# EAGLE design GNSS_Chip_Antenna_Evaluation_Board (EAGLE 9.3.0)
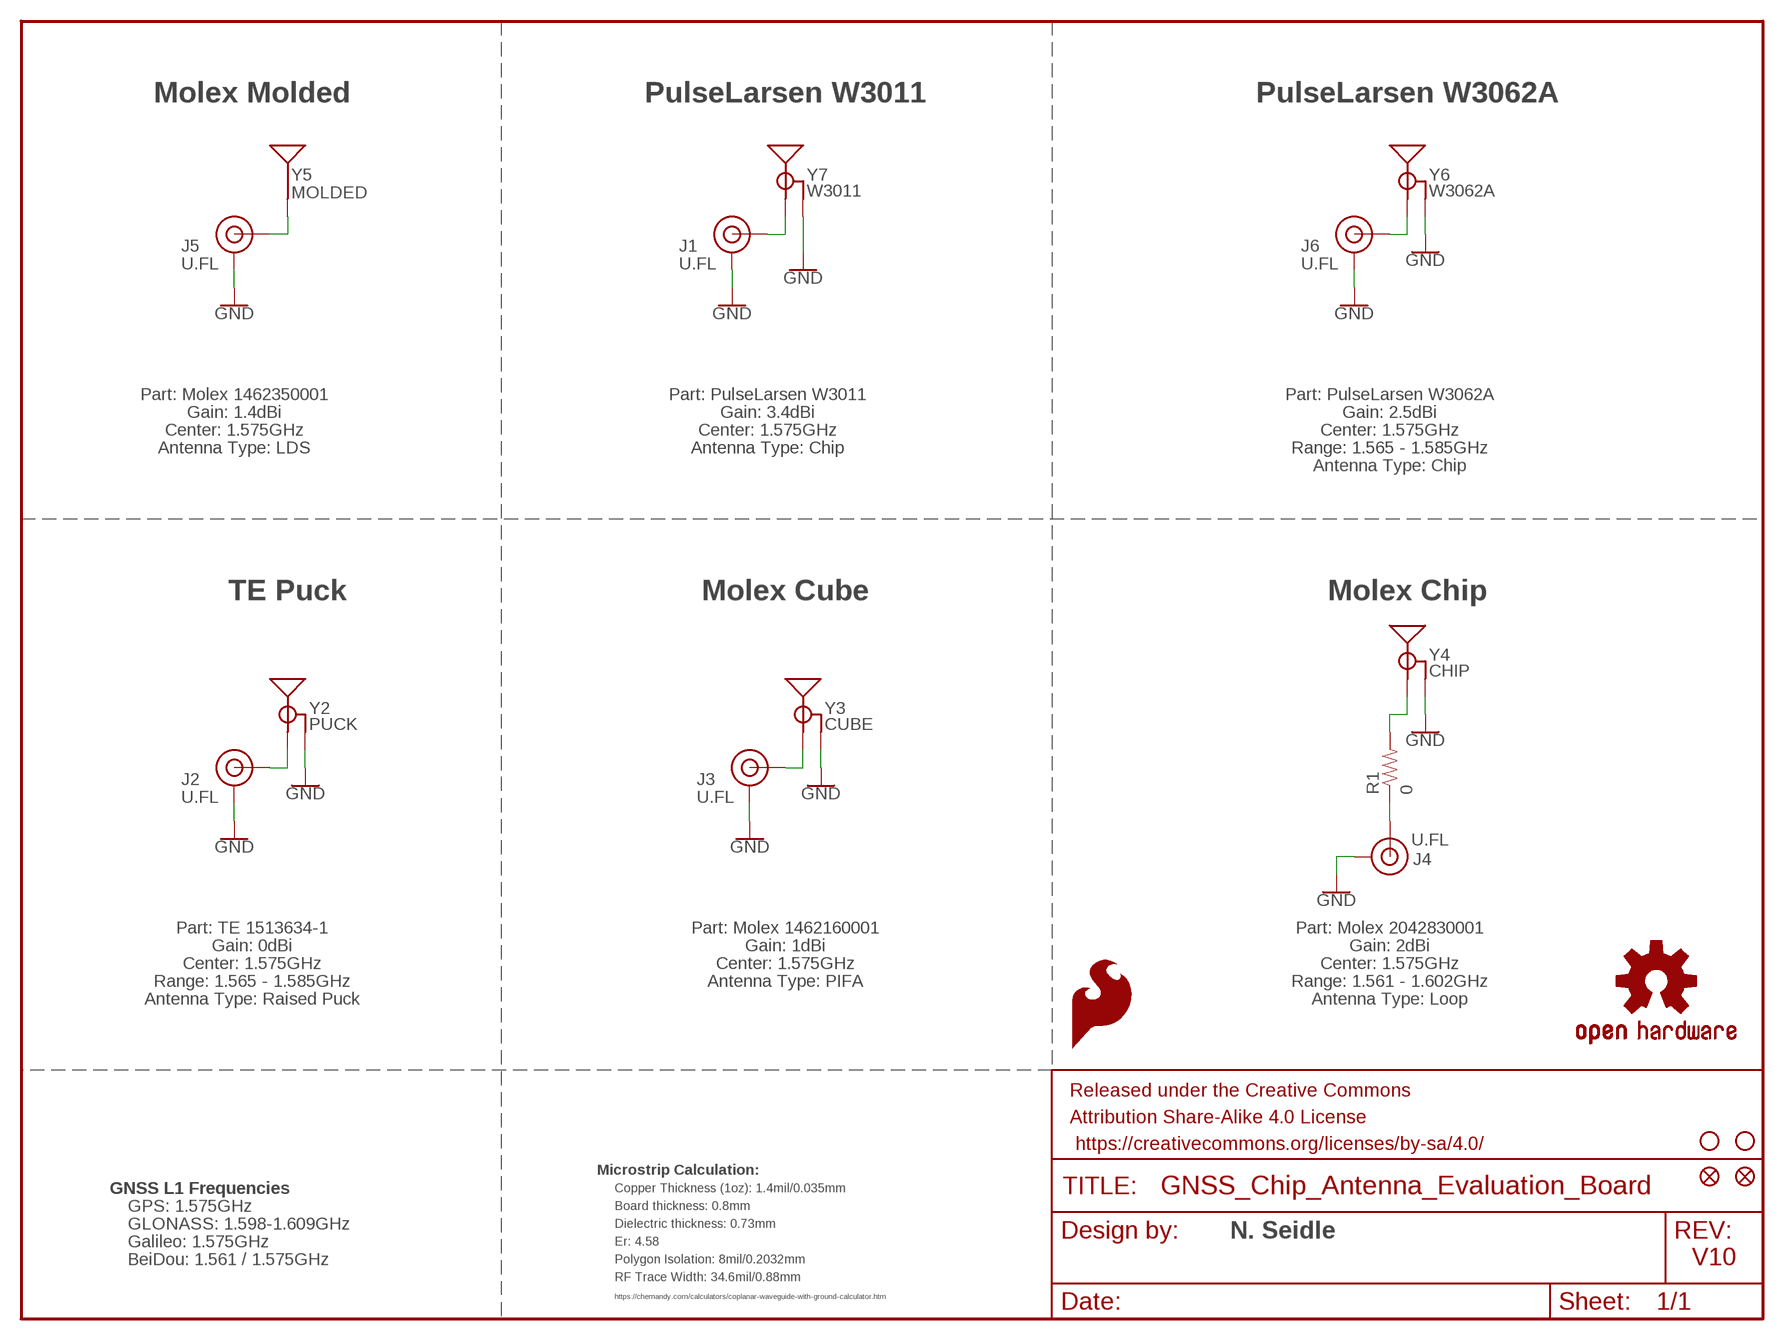
[diagram p0: schematic, sheet 1]

## Parts
FRAME1  FRAME-LETTER  [CREATIVE_COMMONS]
J1  U.FL  U.FL2PIN  [U.FL]
J2  U.FL  U.FL2PIN  [U.FL]
J3  U.FL  U.FL2PIN  [U.FL]
J4  U.FL  U.FL2PIN  [U.FL]
J5  U.FL  U.FL2PIN  [U.FL]
J6  U.FL  U.FL2PIN  [U.FL]
JP5  STAND-OFF  [STAND-OFF]
JP6  STAND-OFF  [STAND-OFF]
JP8  FIDUCIAL1X2  [FIDUCIAL-1X2]
JP9  FIDUCIAL1X2  [FIDUCIAL-1X2]
LOGO1  SFE_LOGO_FLAME.1EXP  [SFE_LOGO_FLAME_COPPER_EXPOSED_.1]
LOGO2  SFE_LOGO_FLAME.1EXP  [SFE_LOGO_FLAME_COPPER_EXPOSED_.1]
LOGO3  SFE_LOGO_FLAME.1EXP  [SFE_LOGO_FLAME_COPPER_EXPOSED_.1]
LOGO4  SFE_LOGO_FLAME.1EXP  [SFE_LOGO_FLAME_COPPER_EXPOSED_.1]
LOGO5  SFE_LOGO_FLAME.1EXP  [SFE_LOGO_FLAME_COPPER_EXPOSED_.1]
LOGO6  SFE_LOGO_FLAME.1EXP  [SFE_LOGO_FLAME_COPPER_EXPOSED_.1]
R1  0  0OHM-0402-1/10W  [0402]
U$16  OSHW-LOGOS  [OSHW-LOGO-S]
Y2  PUCK  GPS_CHIP_ANTENNAPUCK  [TE_PUCK]
Y3  CUBE  GPS_CHIP_ANTENNACUBE  [MOLEX_GNSS_CUBE]
Y4  CHIP  GPS_CHIP_ANTENNA2042830001  [MOLEX_GNSS_CHIP]
Y5  MOLDED  GPS_CHIP_ANTENNA_NOGNDMOLDED  [MLOEX_GNSS_MOLDED]
Y6  W3062A  GPS_CHIP_ANTENNAW3062A  [W3062A]
Y7  W3011  GPS_CHIP_ANTENNAW3011  [W3011]

## Nets
FEED1: J1.FEED(SIGNAL) Y7.1(SIGNAL)
FEED2: J5.FEED(SIGNAL) Y5.FEED(SIGNAL)
FEED3: J2.FEED(SIGNAL) Y2.S(SIGNAL)
FEED4: J3.FEED(SIGNAL) Y3.FEED(SIGNAL)
FEED5: J4.FEED(SIGNAL) R1.1
FEED6: J6.FEED(SIGNAL) Y6.FEED(SIGNAL)
GND: J1.1(GND) J1.2(GND) J2.1(GND) J2.2(GND) J3.1(GND) J3.2(GND) J4.1(GND) J4.2(GND) J5.1(GND) J5.2(GND) J6.1(GND) J6.2(GND) Y2.1(GND) Y2.2(GND) Y2.3(GND) Y3.GND Y4.1(GND) Y4.2(GND) Y4.3(GND) Y6.GND Y7.2(GND) Y7.3(GND)
N$5: R1.2 Y4.FEED(SIGNAL)

## Notes on the sheet
- Molex Molded | PulseLarsen W3011 | PulseLarsen W3062A
- Part: Molex 1462350001 | Part: PulseLarsen W3011 | Part: PulseLarsen W3062A
- Gain: 1.4dBi | Gain: 3.4dBi | Gain: 2.5dBi
- Center: 1.575GHz | Center: 1.575GHz | Center: 1.575GHz
- Antenna Type: LDS | Antenna Type: Chip | Range: 1.565 - 1.585GHz
- Antenna Type: Chip
- TE Puck | Molex Cube | Molex Chip
- Part: TE 1513634-1 | Part: Molex 1462160001 | Part: Molex 2042830001
- Gain: 0dBi | Gain: 1dBi | Gain: 2dBi
- Center: 1.575GHz | Center: 1.575GHz | Center: 1.575GHz
- Range: 1.565 - 1.585GHz | Antenna Type: PIFA | Range: 1.561 - 1.602GHz
- Antenna Type: Raised Puck | Antenna Type: Loop
- Microstrip Calculation:
- GNSS L1 Frequencies | Copper Thickness (1oz): 1.4mil/0.035mm
- GPS: 1.575GHz | Board thickness: 0.8mm
- GLONASS: 1.598-1.609GHz | Dielectric thickness: 0.73mm | N. Seidle
- Galileo: 1.575GHz | Er: 4.58
- BeiDou: 1.561 / 1.575GHz | Polygon Isolation: 8mil/0.2032mm | V10
- RF Trace Width: 34.6mil/0.88mm
- https://chemandy.com/calculators/coplanar-waveguide-with-ground-calculator.htm

## Library data of the parts
FRAME1 = SparkFun-Aesthetics:FRAME-LETTER: Schematic Frame - Letter Standard 8.5x11 US Letter frame
J1-J6 = SparkFun-Connectors:U.FL2PIN: SMD Antenna Connector - U.FL 2mm height, 3.0mm x 3.0mm receptacle size. SparkFun Products: SparkFun WiFi Shield - ESP8266 <https://www.sparkfun.com/products/13287> SparkFun ESP8266 Thing <https://www.sparkfun.com/products/13231> SparkFun MiniGen - Pro Mini Signal Generator Shield <https://www.sparkfun.com/products/11420>; PROD_ID: CONN-09193; SF_ID: WRL-09144
JP5 JP6 = SparkFun:STAND-OFF: Stand Off This is the mechanical footprint for a #4 phillips button head screw. Use the keepout ring to avoid running the screw head into surrounding components. SKU : PRT-00447
JP8 JP9 = SparkFun:FIDUCIAL: Fiducial Alignment Points Various fiducial points for machine vision alignment.
LOGO1-LOGO6 = SparkFun-Aesthetics:SFE_LOGO_FLAME: SparkFun Flame Logo This is the SparkFun flame logo. The logo on the schematic will always be the same size; the package variant is the height of the flame. Default layer for the logo on the board is tSilk.
R1 = SparkFun-Resistors:0OHM: 0Ω resistor A resistor is a passive two-terminal electrical component that implements electrical resistance as a circuit element. Resistors act to reduce current flow, and, at the same time, act to lower voltage levels within circuits. - Wikipedia; PROD_ID: RES-14244
U$16 = SparkFun-Aesthetics:OSHW-LOGO: Open-Source Hardware (OSHW) Logo This logo indicates the piece of hardware it is found on incorporates a OSHW license and/or adheres to the definition of open source hardware found here: http://freedomdefined.org/OSHW
Y2 = SparkFun-GPS:GPS_CHIP_ANTENNA; PROD_ID: ANT-14308
Y3 = SparkFun-GPS:GPS_CHIP_ANTENNA; PROD_ID: ANT-14307
Y4 = SparkFun-GPS:GPS_CHIP_ANTENNA; PROD_ID: ANT-14306
Y5 = SparkFun-GPS:GPS_CHIP_ANTENNA_NOGND; PROD_ID: ANT-14303
Y6 = SparkFun-GPS:GPS_CHIP_ANTENNA; PROD_ID: ANT-14305
Y7 = SparkFun-GPS:GPS_CHIP_ANTENNA; PROD_ID: ANT-14304

## Net classes
1 power: width 0.178 mm

## Board
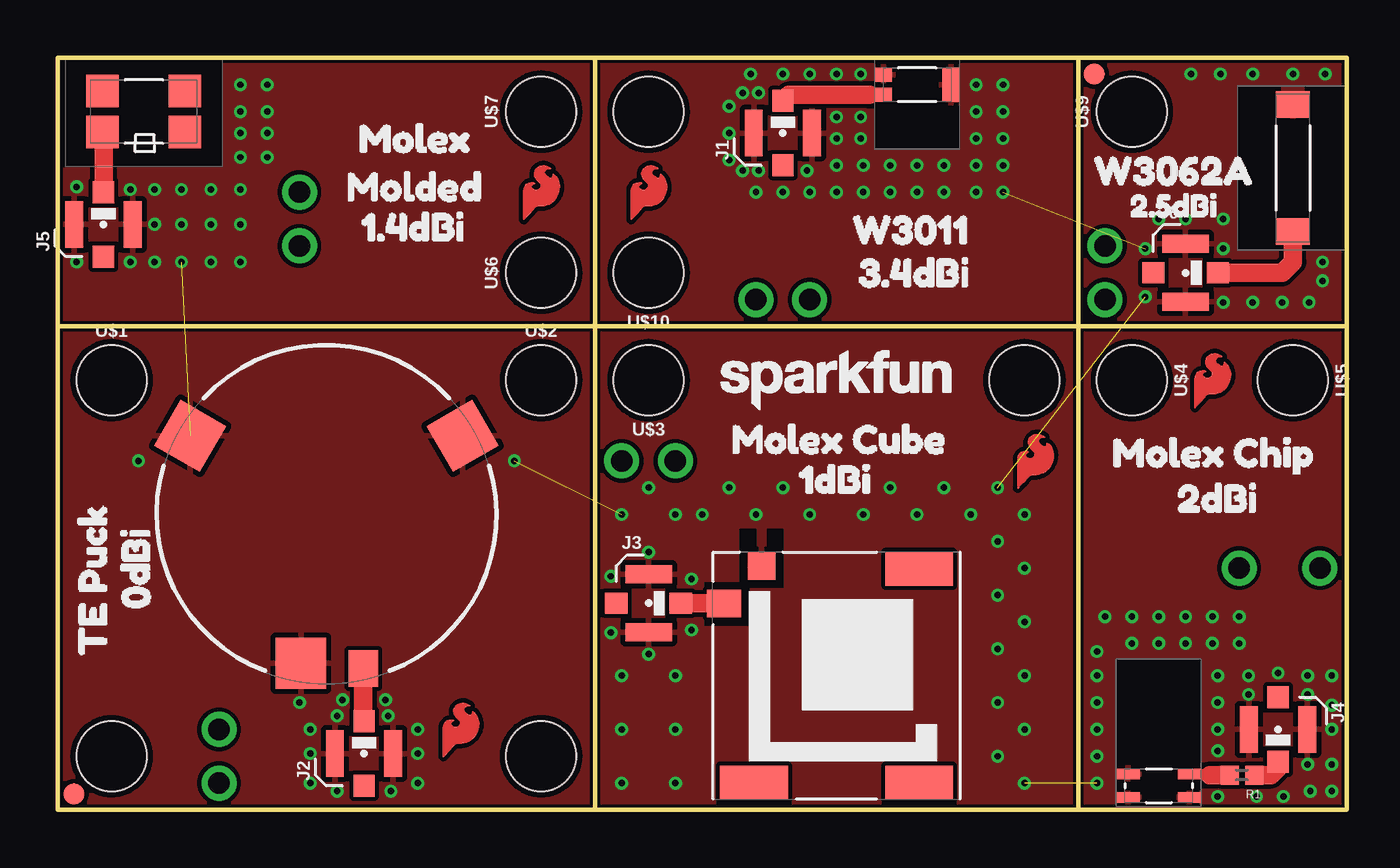
[diagram p1: board, top side]
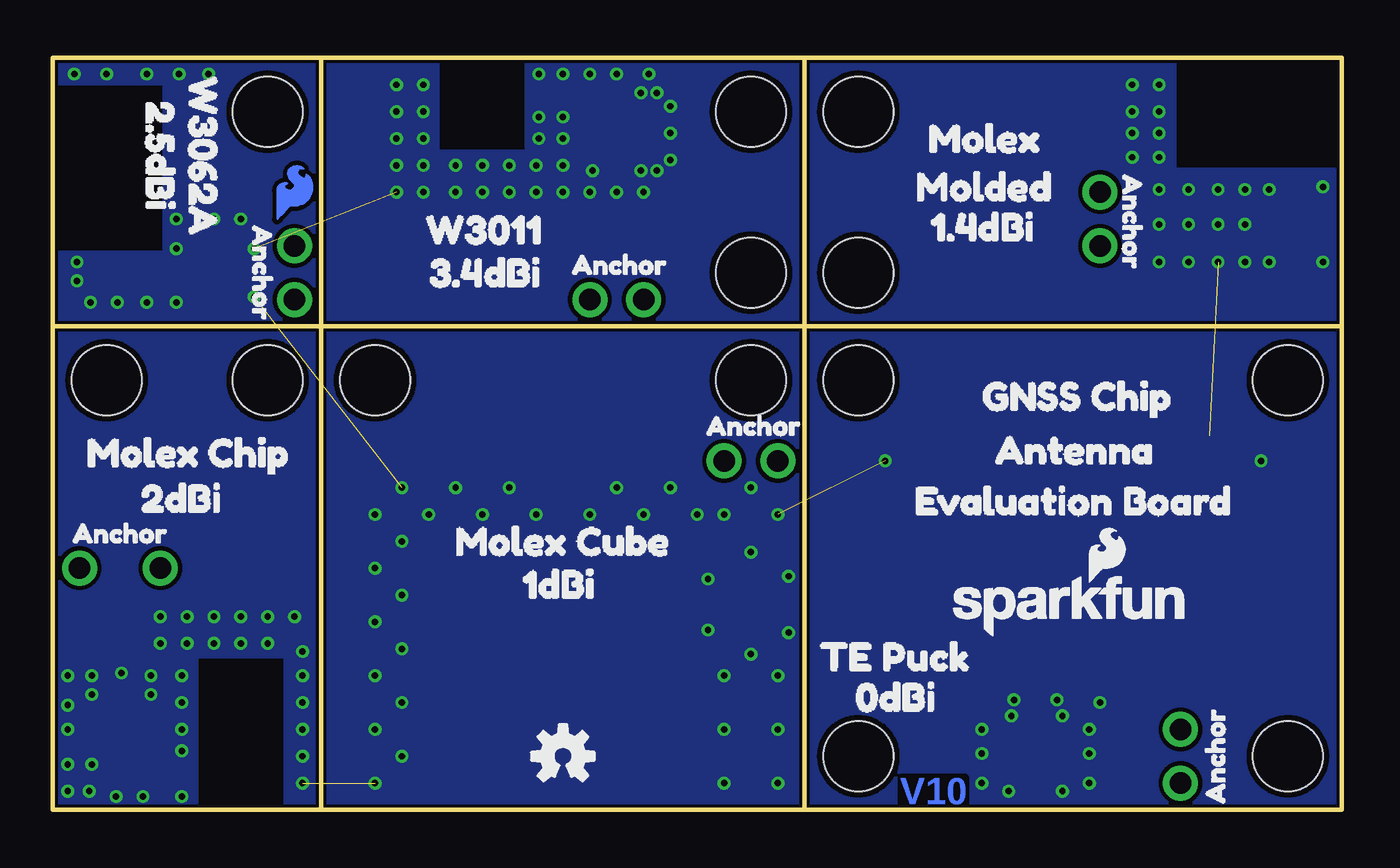
[diagram p2: board, bottom side, seen from below]

Size 60.96 x 35.56 mm. Coordinates in mm from the lower left corner, seen from the top.
Outline: 25.4,35.56 25.4,0
Outline: 48.26,35.56 48.26,0
Outline: 0,22.86 60.96,22.86
Outline: 0,35.56 60.96,35.56 60.96,0 0,0 0,35.56
Copper layers (1*16): Top 0.035mm / dielectric 1.5mm / Bottom 0.035mm
Design rules "SparkFun-2-layer-PCBWay-LIMIT *": minimum track width 6mil, minimum drill 0.3mm, track to track 8mil, track to pad 8mil, pad to pad 8mil, via to via 8mil, smd to smd 8mil, copper to edge 6mil, drill to drill 6mil, minimum pad ring 6mil, minimum via ring 6mil, stop-mask expansion 4mil, vias tented up to drill 25mil, thermal gap 10mil

### Footprints (pad centres in the part's own frame; a part is rotated, then mirrored left to right if it is on the bottom)
U.FL = smd 2.2 x 0.85: 1 0,1.375; 2 0,-1.375 | smd 1.05 x 1: FEED 1.525,0; NC -1.525,0
STAND-OFF = hole 3.302: 0,0
FIDUCIAL-1X2 = smd 1 x 1: 1 0,0
0402 = smd 0.85 x 0.9: 1 -0.58,0; 2 0.58,0
TE_PUCK = smd 2.4 x 2.4: 1 -1.2,-7.03 | smd 2.5 x 2.5 rotated 60: 2 -6.443,3.72 | smd 2.5 x 2.5 rotated 300: 3 6.443,3.72 | smd 1.4 x 1.74: S 1.75,-7.28
MOLEX_GNSS_CUBE = smd 1.61 x 1.3: FEED 5.33,-3.4 | smd 1.3 x 1.32: GND 3.545,-5.2 | smd 3.2 x 1.6: NC1 -3.905,-5.06; NC2 -3.905,5.06; NC3 3.905,5.06
MOLEX_GNSS_CHIP = smd 1.1 x 0.5: 1 1.45,-0.55; 2 -1.45,-0.55; 3 -1.45,0.55; FEED 1.45,0.55
MLOEX_GNSS_MOLDED = smd 1.54 x 1.54: 1 -0.97,-1.95; 2 -0.97,1.95; 3 0.97,1.95; FEED 0.97,-1.95
W3062A = smd 1.25 x 1.61: FEED 3,0; GND -3,0
W3011 = smd 0.8 x 0.65: 1 1.6,0.475; 2 1.6,-0.475 | smd 0.8 x 1.6: 3 -1.6,0

### Placement (x,y rotation side)
FRAME1  3.81,-12.7 0 top  (outside the outline)
J1  34.29,32 90 top
J2  14.48,2.67 90 top
J3  27.94,9.78 0 top
J4  57.72,3.81 270 top
J5  2.16,27.69 90 top
J6  53.34,25.4 0 top
JP1  STAND-OFF  [STAND-OFF]  22.86,2.54 0 top
JP2  STAND-OFF  [STAND-OFF]  2.54,2.54 0 top
JP5  45.72,20.32 180 top
JP6  27.94,33.02 180 top
JP8  49.02,34.8 0 top
JP9  0.76,0.76 0 top
LOGO1  49.53,29.21 0 bottom
LOGO2  54.61,20.32 0 top
LOGO3  27.94,29.21 0 top
LOGO4  22.86,29.21 0 top
LOGO5  46.23,16.51 0 top
LOGO6  19.05,3.81 0 top
R1  56.01,1.65 180 top
U$1  [STAND-OFF]  2.54,20.32 0 top
U$2  [STAND-OFF]  22.86,20.32 0 top
U$3  [STAND-OFF]  27.94,20.32 180 top
U$4  [STAND-OFF]  50.8,20.32 270 top
U$5  [STAND-OFF]  58.42,20.32 270 top
U$6  [STAND-OFF]  22.86,25.4 90 top
U$7  [STAND-OFF]  22.86,33.02 90 top
U$8  [ANCHOR0]  9.91,30.86 270 bottom
U$9  [STAND-OFF]  50.8,33.02 90 top
U$10  [STAND-OFF]  27.94,25.4 180 top
U$11  [3#4DBI2]  36.7,25.4 0 top
U$12  [0DBI0]  3.68,8.38 90 top
U$13  [TE_PUCK7]  25.78,7.24 0 bottom
U$14  [1#4DBI3]  13.21,27.56 0 top
U$15  [1DBI1]  33.91,15.62 0 top
U$16  36.83,2.54 0 bottom
U$17  [ORDERING_INSTRUCTIONS]  64.77,50.8 0 top  (outside the outline)
U$18  [2DBI2]  51.82,14.73 0 top
U$19  [MOLEX_CHIP5]  48.77,16.89 0 top
U$20  [MOLEX_CHIP5]  60.45,16.89 0 bottom
U$21  [MOLEX0]  20.7,31.75 0 bottom
U$22  [MOLEX0]  13.08,31.75 0 top
U$23  [SFE_LOGO_NAME_.1]  36.83,20.32 0 top
U$24  [ANCHOR0]  5.97,-0.51 90 bottom
U$25  [ANCHOR0]  30.86,18.16 0 bottom
U$26  [ANCHOR0]  37.21,25.78 0 bottom
U$27  [ANCHOR0]  60.83,13.08 0 bottom
U$28  [ANCHOR0]  51.05,28.45 270 bottom
U$29  [MOLDED1]  12.32,29.46 0 top
U$30  [MOLDED1]  21.46,29.46 0 bottom
U$31  [MOLEX_CUBE6]  43.05,12.7 0 bottom
U$32  [1#4DBI3]  20.57,27.56 0 bottom
U$33  [W30112]  44.45,27.43 0 bottom
U$34  [3#4DBI2]  44.32,25.4 0 bottom
U$35  [W3062A3]  53.85,35.81 270 bottom
U$36  [2#5DBI4]  55.88,34.67 270 bottom
U$37  [SFE_LOGO_NAME_FLAME_.1]  12.83,9.65 0 bottom
U$38  [2DBI2]  57.91,14.73 0 bottom
U$39  [1DBI1]  39.88,10.67 0 bottom
U$42  [0DBI0]  24.13,5.33 0 bottom
U$43  [ANTENNA10]  17.53,17.02 0 bottom
U$44  [2#5DBI2]  49.78,28.57 0 top
U$50  [EVALUATION_BOARD15]  21.34,14.61 0 bottom
U$52  [GNSS_CHIP13]  18.16,19.56 0 bottom
U$56  [MOLEX_CUBE6]  30.73,17.53 0 top
U$57  [TE_PUCK7]  1.65,6.22 90 top
U$58  [W3062A3]  47.88,30.23 0 top
U$59  [W30112]  36.45,27.43 0 top
Y2  12.7,13.97 0 top
Y3  36.83,6.35 180 top
Y4  52.07,1.14 0 top
Y5  4.06,33.02 270 top
Y6  58.42,30.35 270 top
Y7  40.64,34.29 180 top

### Tracks (layer width: path | path; a pad name or v marks a point on that pad's centre or on a via)
A1  (via drill 1.02 pad 1.65)
  other vias: 11.43,29.21
FEED1
  Top 0.152: 38.79,33.81 Y7.1 38.39,33.81
  Top 0.879: J1.FEED 34.58,33.81 38.39,33.81
FEED2
  Top 0.203: Y5.FEED 2.16,32.01 | 2.16,32.01 | J5.FEED
  Top 0.879: J5.FEED 2.16,32.01
FEED3
  Top 0.879: J2.FEED 14.45,4.22 Y2.S
FEED4
  Top 0.203: Y3.FEED 31.47,9.78 31.36,9.78
  Top 0.879: J3.FEED 31.36,9.78
FEED5
  Top 0.879: R1.1 57.38,1.65 57.72,1.99 J4.FEED
FEED6
  Top 0.879: J6.FEED 57.91,25.4 58.42,25.91 Y6.FEED
GND  (via drill 0.3)  (5 unrouted)
  other vias: 43.43,34.29 43.43,33.02 43.43,31.75 43.43,30.48 43.43,29.21 41.91,30.48 40.64,30.48 41.91,29.21 39.37,30.48 38.1,30.48 36.83,30.48 35.43,30.23 34.29,29.21 33.02,29.21 33.15,30.23 32.38,30.23 37.97,31.75 36.83,31.75 37.97,32.77 36.83,32.77 37.97,34.8 36.83,34.8 35.56,34.8 34.29,34.8 33.15,33.91 32.38,33.91 11.94,3.81 11.94,1.27 13.21,0.89 13.21,4.45 13.46,5.21 15.49,5.21 15.62,4.45 17.02,2.67 11.94,2.67 17.02,3.81 17.02,1.27 15.75,0.89 35.56,13.97 38.1,13.97 40.64,13.97 43.18,13.97 45.72,13.97 45.72,11.43 45.72,8.89 45.72,6.35 45.72,3.81 45.72,1.27 33.02,13.97 30.48,13.97 29.21,13.97 26.67,6.35 29.21,6.35 29.21,3.81 26.67,3.81 26.67,1.27 29.21,1.27 29.97,10.92 29.97,8.51 26.16,8.38 26.16,11.05 27.94,12.19 27.94,7.37 49.15,1.27 49.15,2.54 49.15,3.81 49.15,5.08 49.15,6.35 49.15,7.49 50.8,7.87 52.07,7.87 53.34,7.87 54.61,7.87 54.86,6.35 54.86,5.08 54.86,3.81 54.86,2.79 56.32,5.46 59.11,5.46 60.26,3.81 59.11,2.16 60.26,2.16 60.26,4.95 54.86,0.64 56.7,0.64 57.97,0.64 59.24,0.89 60.26,0.89 56.32,6.35 57.72,6.48 59.11,6.35 60.26,6.35 0.89,25.91 32.77,34.8 3.43,25.91 3.43,29.34 0.89,29.46 4.57,27.69 4.57,25.91 4.57,29.34 5.84,29.34 7.24,29.34 8.64,29.34 8.64,30.86 8.64,33.02 8.64,34.29 5.84,27.69 7.24,27.69 8.64,27.69 5.84,25.91 7.24,25.91 8.64,25.91 8.64,32 9.91,34.29 9.91,33.02 9.91,32 9.91,30.86 3.81,16.51 21.59,16.51 11.43,5.08 44.45,12.7 44.45,10.16 44.45,7.62 44.45,5.08 44.45,2.54 41.91,15.24 39.37,15.24 34.29,15.24 31.75,15.24 27.94,15.24 44.45,15.24 50.8,9.14 52.07,9.14 53.34,9.14 54.61,9.14 49.53,9.14 55.88,9.14 55.88,7.87 40.64,29.21 39.37,29.21 38.1,29.21 36.83,29.21 35.56,29.21 44.7,29.21 44.7,30.48 44.7,31.75 44.7,33.02 44.7,34.29 31.75,32 31.75,33.27 31.75,30.73 55.12,24 55.12,26.54 53.34,27.94 55.12,27.94 52.07,27.94 51.44,26.54 51.44,24.26 56.52,24 57.91,24 59.18,24 59.82,25.02 59.82,25.91 59.94,34.8 58.42,34.8 56.52,34.8 54.99,34.8 53.59,34.8 26.67,13.97
  pour Top (rank 2): 48.26,22.86 25.4,22.86 25.4,35.56 48.26,35.56
  pour Bottom (rank 2): 48.26,22.86 25.4,22.86 25.4,35.56 48.26,35.56
  pour Top (no thermals): 42.04,33.53 42.67,33.53 42.67,33.02 43.56,33.02 43.56,35.56 42.67,35.56 42.67,35.05 42.04,35.05
  pour Top (no thermals): 39.24,34.52 38.23,34.52 38.23,35.31 38.61,35.31 38.61,35 39.24,35
  pour Top: 0,22.86 25.4,22.86 25.4,0 0,0
  pour Bottom: 0,22.86 25.4,22.86 25.4,0 0,0
  pour Bottom: 48.26,0 25.4,0 25.4,22.86 48.26,22.86
  pour Top: 48.26,0 25.4,0 25.4,22.86 48.26,22.86
  pour Top: 48.26,22.86 60.96,22.86 60.96,0 48.26,0
  pour Bottom: 48.26,22.86 60.96,22.86 60.96,0 48.26,0
  pour Top (no thermals): 50.26,1.9 50.05,1.9 50.05,2.3 49.46,2.3 49.46,1.2 50.05,1.2 50.05,1.5 50.26,1.5
  pour Top (no thermals): 50.23,0.8 50.05,0.8 50.05,1.19 49.4,1.19 49.4,0.1 50.05,0.1 50.05,0.4 50.23,0.4
  pour Bottom: 0,22.86 0,35.56 25.4,35.56 25.4,22.86
  pour Top: 0,22.86 0,35.56 25.4,35.56 25.4,22.86
  pour Top: 48.26,22.86 48.26,35.56 60.96,35.56 60.96,22.86
  pour Bottom: 48.26,22.86 48.26,35.56 60.96,35.56 60.96,22.86
  pour Top (no thermals): 54.05,0.8 54.05,1 54.8,1 54.8,0.2 54.05,0.2 54.05,0.35 53.7,0.35 53.7,0.8
  pour Top (no thermals): 57.56,34.3 57.86,34.3 57.86,33.7 58.96,33.7 58.96,34.3 59.36,34.3 59.36,34.5 57.56,34.5
N$1  (via drill 1.02 pad 1.65)
  other vias: 33.02,24.13
N$5
  Top 0.203: 54.48,1.65 54.48,1.66 54.45,1.69
  Top 0.483: 54.45,1.69 Y4.FEED
  Top 0.879: R1.2 54.48,1.65
N$8  (via drill 1.02 pad 1.65)
  other vias: 7.62,3.81
N$10  (via drill 1.02 pad 1.65)
  other vias: 49.53,26.67
N$11  (via drill 1.02 pad 1.65)
  other vias: 49.53,24.13
N$13  (via drill 1.02 pad 1.65)
  other vias: 11.43,26.67
N$14  (via drill 1.02 pad 1.65)
  other vias: 7.62,1.27
N$16  (via drill 1.02 pad 1.65)
  other vias: 55.88,11.43
N$17  (via drill 1.02 pad 1.65)
  other vias: 59.69,11.43
N$18  (via drill 1.02 pad 1.65)
  other vias: 35.56,24.13
N$19  (via drill 1.02 pad 1.65)
  other vias: 29.21,16.51
N$20  (via drill 1.02 pad 1.65)
  other vias: 26.67,16.51

### Text on the board
Bottom: V10
Measures: Units in inches
tDocu: 0.8mm Board Thickness
214bmp: D:/SmartProjects/Snc/a4_bn_logo2.bmp